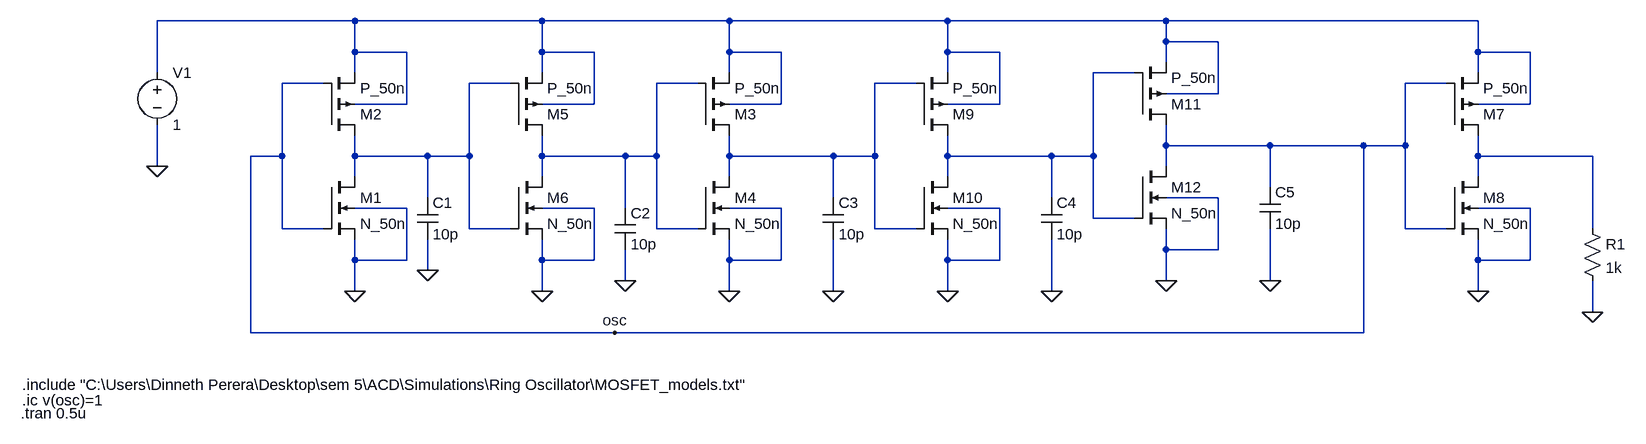
[diagram p0: schematic Ring Oscillator.asc]
Ring Oscillator.asc, the LTspice schematic file:
Version 4
SHEET 1 2536 680
WIRE 112 -336 -192 -336
WIRE 400 -336 112 -336
WIRE 688 -336 400 -336
WIRE 1024 -336 688 -336
WIRE 1360 -336 1024 -336
WIRE 1840 -336 1360 -336
WIRE 1360 -304 1360 -336
WIRE 1440 -304 1360 -304
WIRE 112 -288 112 -336
WIRE 192 -288 112 -288
WIRE 400 -288 400 -336
WIRE 480 -288 400 -288
WIRE 688 -288 688 -336
WIRE 768 -288 688 -288
WIRE 1024 -288 1024 -336
WIRE 1104 -288 1024 -288
WIRE 1840 -288 1840 -336
WIRE 1920 -288 1840 -288
WIRE 1360 -272 1360 -304
WIRE -192 -256 -192 -336
WIRE 112 -256 112 -288
WIRE 400 -256 400 -288
WIRE 688 -256 688 -288
WIRE 1024 -256 1024 -288
WIRE 1312 -256 1248 -256
WIRE 1840 -256 1840 -288
WIRE 64 -240 0 -240
WIRE 352 -240 288 -240
WIRE 640 -240 576 -240
WIRE 976 -240 912 -240
WIRE 1792 -240 1728 -240
WIRE 1440 -224 1440 -304
WIRE 1440 -224 1360 -224
WIRE 192 -208 192 -288
WIRE 192 -208 112 -208
WIRE 480 -208 480 -288
WIRE 480 -208 400 -208
WIRE 768 -208 768 -288
WIRE 768 -208 688 -208
WIRE 1104 -208 1104 -288
WIRE 1104 -208 1024 -208
WIRE 1920 -208 1920 -288
WIRE 1920 -208 1840 -208
WIRE 1360 -144 1360 -176
WIRE 1520 -144 1360 -144
WIRE 1664 -144 1520 -144
WIRE 1728 -144 1728 -240
WIRE 1728 -144 1664 -144
WIRE 0 -128 0 -240
WIRE 0 -128 -48 -128
WIRE 112 -128 112 -160
WIRE 224 -128 112 -128
WIRE 288 -128 288 -240
WIRE 288 -128 224 -128
WIRE 400 -128 400 -160
WIRE 528 -128 400 -128
WIRE 576 -128 576 -240
WIRE 576 -128 528 -128
WIRE 688 -128 688 -160
WIRE 848 -128 688 -128
WIRE 912 -128 912 -240
WIRE 912 -128 848 -128
WIRE 1024 -128 1024 -160
WIRE 1184 -128 1024 -128
WIRE 1248 -128 1248 -256
WIRE 1248 -128 1184 -128
WIRE 1840 -128 1840 -160
WIRE 2016 -128 1840 -128
WIRE -192 -112 -192 -176
WIRE 1360 -112 1360 -144
WIRE 112 -96 112 -128
WIRE 400 -96 400 -128
WIRE 688 -96 688 -128
WIRE 1024 -96 1024 -128
WIRE 1840 -96 1840 -128
WIRE 1520 -80 1520 -144
WIRE 224 -64 224 -128
WIRE 848 -64 848 -128
WIRE 1184 -64 1184 -128
WIRE 1440 -64 1360 -64
WIRE 192 -48 112 -48
WIRE 480 -48 400 -48
WIRE 528 -48 528 -128
WIRE 768 -48 688 -48
WIRE 1104 -48 1024 -48
WIRE 1920 -48 1840 -48
WIRE 1248 -32 1248 -128
WIRE 1312 -32 1248 -32
WIRE 0 -16 0 -128
WIRE 64 -16 0 -16
WIRE 288 -16 288 -128
WIRE 352 -16 288 -16
WIRE 576 -16 576 -128
WIRE 640 -16 576 -16
WIRE 912 -16 912 -128
WIRE 976 -16 912 -16
WIRE 1728 -16 1728 -144
WIRE 1792 -16 1728 -16
WIRE 2016 -16 2016 -128
WIRE 1360 16 1360 -16
WIRE 1440 16 1440 -64
WIRE 1440 16 1360 16
WIRE 112 32 112 0
WIRE 192 32 192 -48
WIRE 192 32 112 32
WIRE 400 32 400 0
WIRE 480 32 480 -48
WIRE 480 32 400 32
WIRE 688 32 688 0
WIRE 768 32 768 -48
WIRE 768 32 688 32
WIRE 1024 32 1024 0
WIRE 1104 32 1104 -48
WIRE 1104 32 1024 32
WIRE 1840 32 1840 0
WIRE 1920 32 1920 -48
WIRE 1920 32 1840 32
WIRE 224 48 224 0
WIRE 528 64 528 16
WIRE 1360 64 1360 16
WIRE 1520 64 1520 -16
WIRE 112 80 112 32
WIRE 400 80 400 32
WIRE 688 80 688 32
WIRE 848 80 848 0
WIRE 1024 80 1024 32
WIRE 1184 80 1184 0
WIRE 1840 80 1840 32
WIRE 2016 112 2016 64
WIRE -48 144 -48 -128
WIRE 512 144 -48 144
WIRE 1664 144 1664 -144
WIRE 1664 144 512 144
FLAG 112 80 0
FLAG -192 -112 0
FLAG 688 80 0
FLAG 400 80 0
FLAG 512 144 osc
FLAG 224 48 0
FLAG 528 64 0
FLAG 848 80 0
FLAG 1840 80 0
FLAG 2016 112 0
FLAG 1024 80 0
FLAG 1184 80 0
FLAG 1360 64 0
FLAG 1520 64 0
SYMBOL voltage -192 -272 R0
WINDOW 123 0 0 Left 2
WINDOW 39 0 0 Left 2
SYMATTR InstName V1
SYMATTR Value 1
SYMBOL pmos4 64 -160 M180
SYMATTR InstName M2
SYMATTR Value P_50n
SYMATTR Value2 l=50n w=1u
SYMBOL nmos4 64 -96 R0
SYMATTR InstName M1
SYMATTR Value N_50n
SYMATTR Value2 l=50n w=500n
SYMBOL pmos4 640 -160 M180
SYMATTR InstName M3
SYMATTR Value P_50n
SYMATTR Value2 l=50n w=1u
SYMBOL nmos4 640 -96 R0
SYMATTR InstName M4
SYMATTR Value N_50n
SYMATTR Value2 l=50n w=500n
SYMBOL pmos4 352 -160 M180
SYMATTR InstName M5
SYMATTR Value P_50n
SYMATTR Value2 l=50n w=1u
SYMBOL nmos4 352 -96 R0
SYMATTR InstName M6
SYMATTR Value N_50n
SYMATTR Value2 l=50n w=500n
SYMBOL cap 208 -64 R0
SYMATTR InstName C1
SYMATTR Value 10p
SYMBOL cap 512 -48 R0
SYMATTR InstName C2
SYMATTR Value 10p
SYMBOL cap 832 -64 R0
SYMATTR InstName C3
SYMATTR Value 10p
SYMBOL pmos4 1792 -160 M180
SYMATTR InstName M7
SYMATTR Value P_50n
SYMATTR Value2 l=50n w=1u
SYMBOL nmos4 1792 -96 R0
SYMATTR InstName M8
SYMATTR Value N_50n
SYMATTR Value2 l=50n w=500n
SYMBOL res 2000 -32 R0
SYMATTR InstName R1
SYMATTR Value 1k
SYMBOL pmos4 976 -160 M180
SYMATTR InstName M9
SYMATTR Value P_50n
SYMATTR Value2 l=50n w=1u
SYMBOL nmos4 976 -96 R0
SYMATTR InstName M10
SYMATTR Value N_50n
SYMATTR Value2 l=50n w=500n
SYMBOL cap 1168 -64 R0
SYMATTR InstName C4
SYMATTR Value 10p
SYMBOL pmos4 1312 -176 M180
SYMATTR InstName M11
SYMATTR Value P_50n
SYMATTR Value2 l=50n w=1u
SYMBOL nmos4 1312 -112 R0
SYMATTR InstName M12
SYMATTR Value N_50n
SYMATTR Value2 l=50n w=500n
SYMBOL cap 1504 -80 R0
SYMATTR InstName C5
SYMATTR Value 10p
TEXT -400 224 Left 2 !.include "C:\\Users\\Dinneth Perera\\Desktop\\sem 5\\ACD\\Simulations\\Ring Oscillator\\MOSFET_models.txt"
TEXT -402 268 Left 2 !.tran 0.5u
TEXT -400 248 Left 2 !.ic v(osc)=1

The netlist it stands for:
* Ring Oscillator.asc
V1 N001 0 1
M2 N003 osc N001 N001 P_50n l=50n w=1u
M1 N003 osc 0 0 N_50n l=50n w=500n
M3 N005 N004 N001 N001 P_50n l=50n w=1u
M4 N005 N004 0 0 N_50n l=50n w=500n
M5 N004 N003 N001 N001 P_50n l=50n w=1u
M6 N004 N003 0 0 N_50n l=50n w=500n
C1 N003 0 10p
C2 N004 0 10p
C3 N005 0 10p
M7 N006 osc N001 N001 P_50n l=50n w=1u
M8 N006 osc 0 0 N_50n l=50n w=500n
R1 N006 0 1k
M9 N002 N005 N001 N001 P_50n l=50n w=1u
M10 N002 N005 0 0 N_50n l=50n w=500n
C4 N002 0 10p
M11 osc N002 N001 N001 P_50n l=50n w=1u
M12 osc N002 0 0 N_50n l=50n w=500n
C5 osc 0 10p
.model NMOS NMOS
.model PMOS PMOS
.lib standard.mos
.include "C:\Users\Dinneth Perera\Desktop\sem 5\ACD\Simulations\Ring Oscillator\MOSFET_models.txt"
.tran 0.5u
.ic v(osc)=1
.backanno
.end